# EAGLE schematic copro (EAGLE 8.4.1)
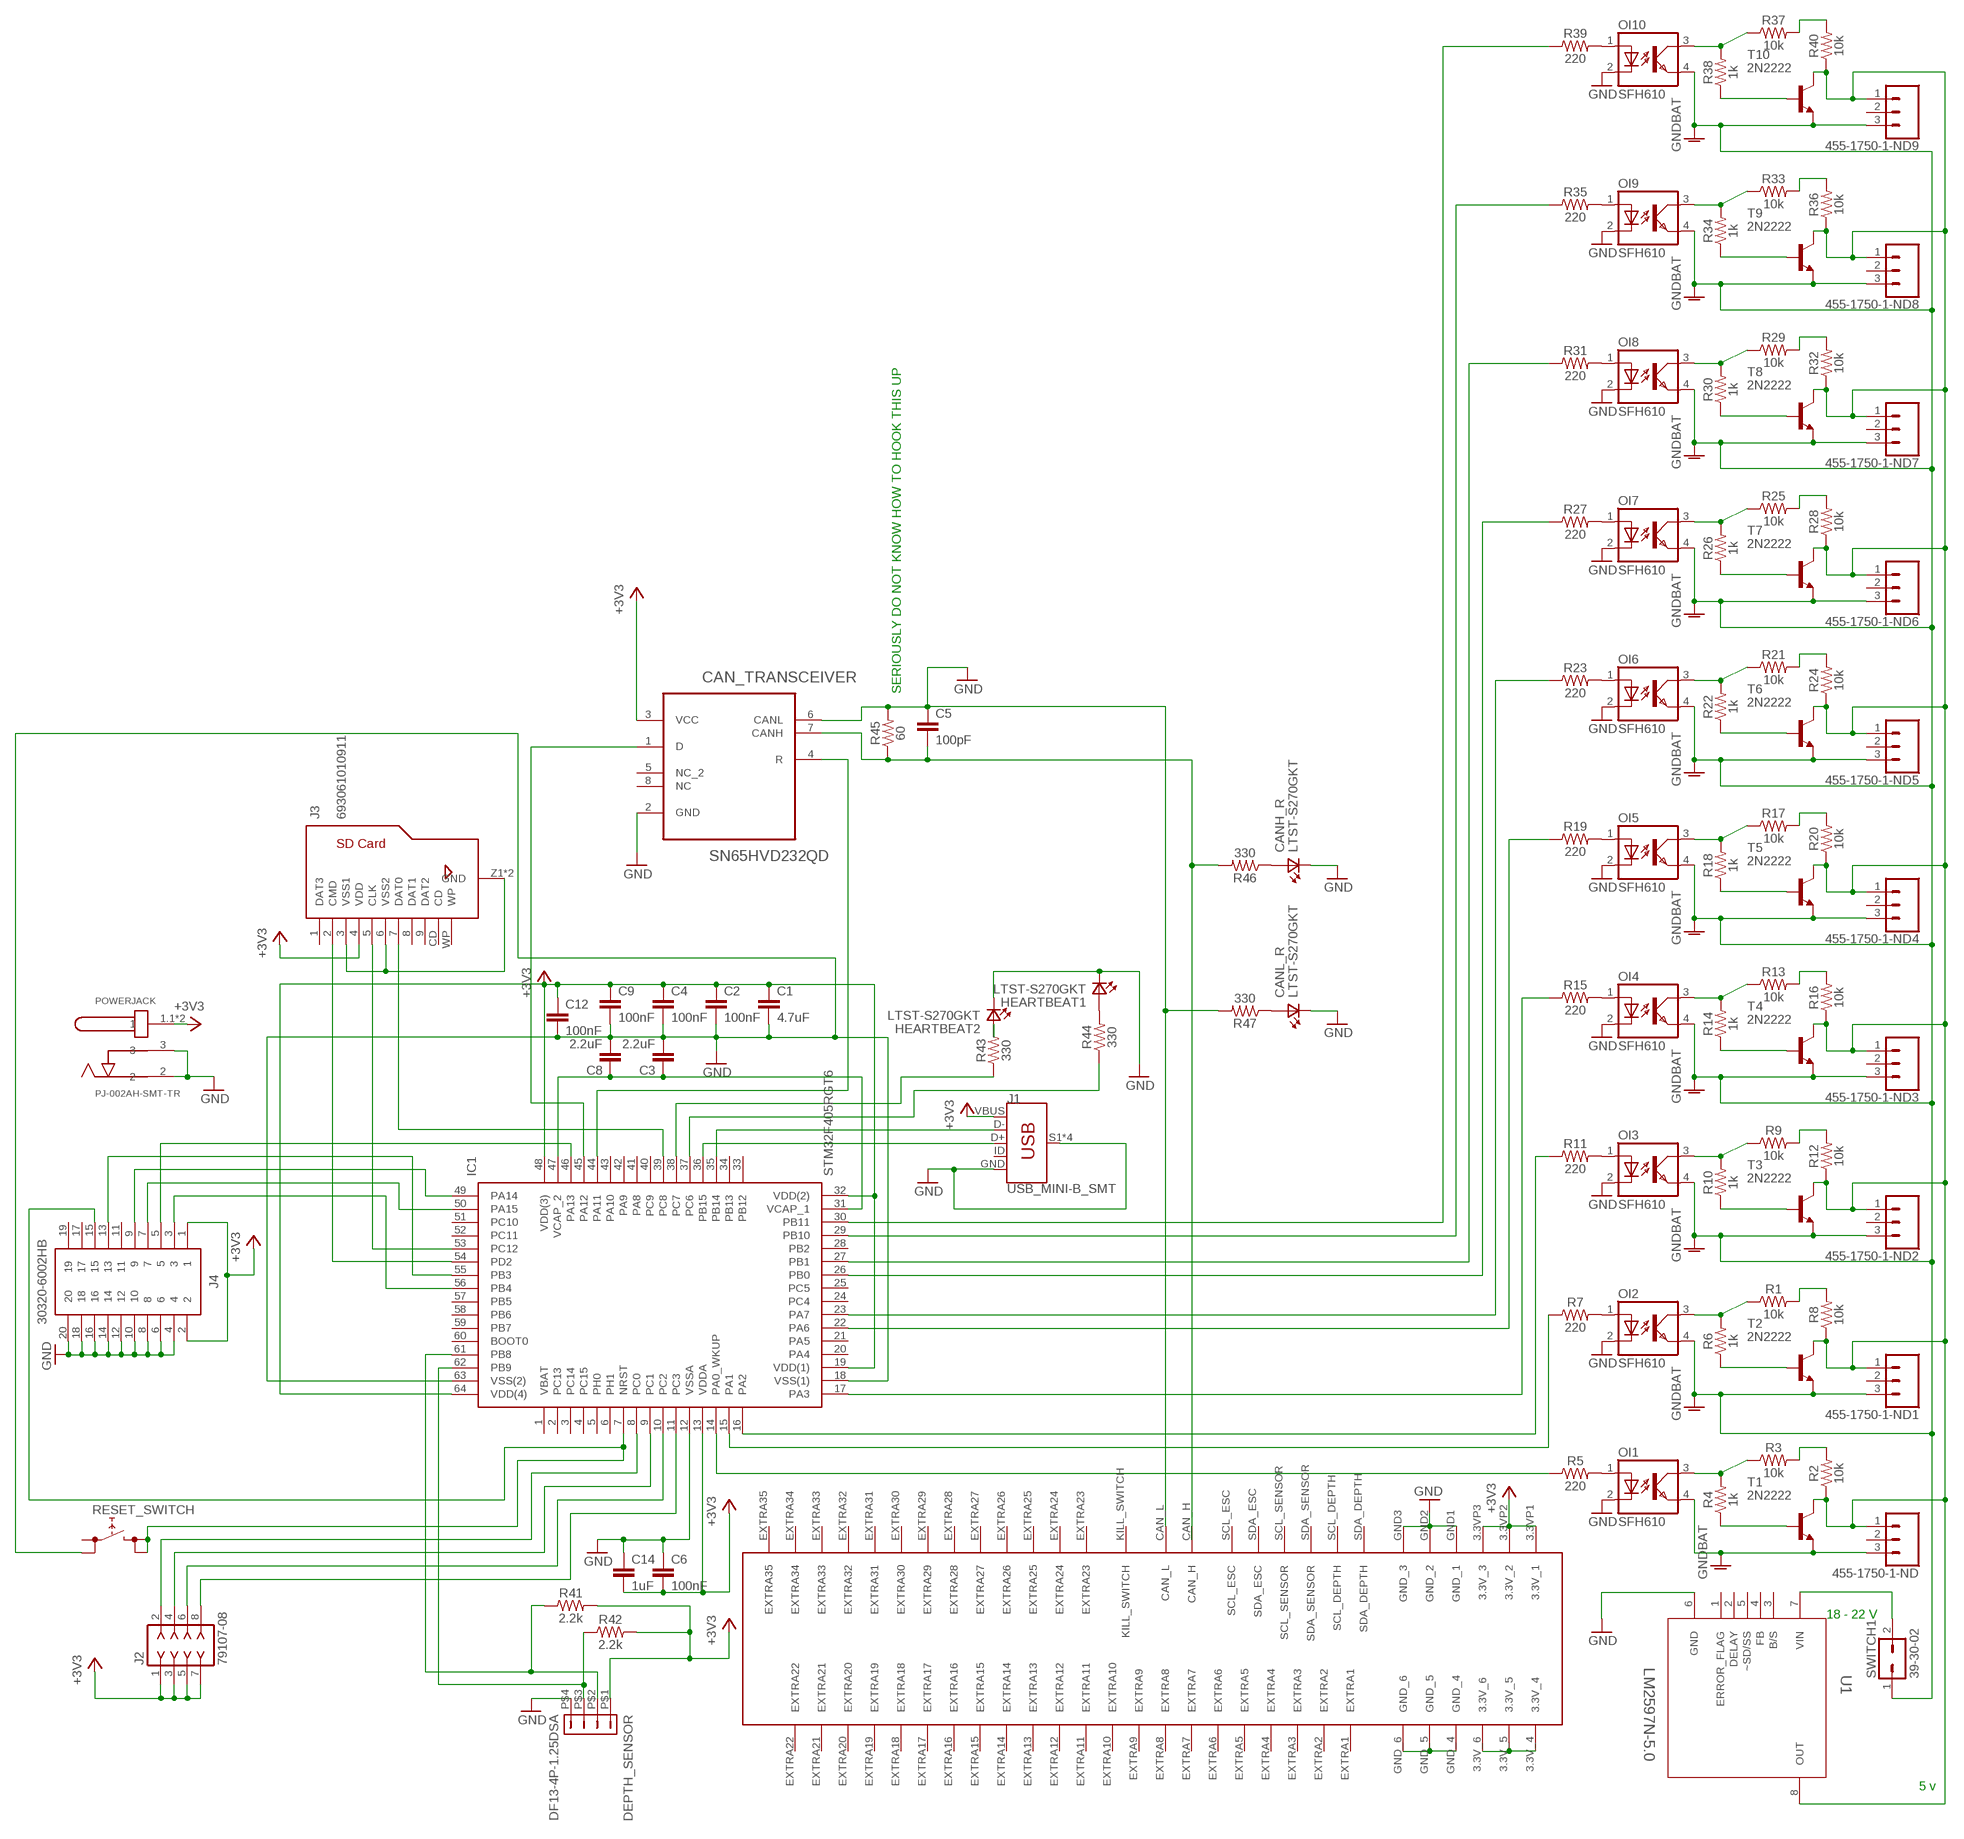
[diagram p0: schematic, sheet 1]

## Parts
455-1750-1-ND  CONN_03  [1X03]
455-1750-1-ND1  CONN_03  [1X03]
455-1750-1-ND2  CONN_03  [1X03]
455-1750-1-ND3  CONN_03  [1X03]
455-1750-1-ND4  CONN_03  [1X03]
455-1750-1-ND5  CONN_03  [1X03]
455-1750-1-ND6  CONN_03  [1X03]
455-1750-1-ND7  CONN_03  [1X03]
455-1750-1-ND8  CONN_03  [1X03]
455-1750-1-ND9  CONN_03  [1X03]
C1  4.7uF  0.1UF-0603-100V-10%  [0603]
C2  100nF  0.1UF-0603-100V-10%  [0603]
C3  2.2uF  0.1UF-0603-100V-10%  [0603]
C4  100nF  0.1UF-0603-100V-10%  [0603]
C5  100pF  0.1UF-0603-100V-10%  [0603]
C6  100nF  0.1UF-0603-100V-10%  [0603]
C8  2.2uF  0.1UF-0603-100V-10%  [0603]
C9  100nF  0.1UF-0603-100V-10%  [0603]
C12  100nF  0.1UF-0603-100V-10%  [0603]
C14  1uF  0.1UF-0603-100V-10%  [0603]
CAN_TRANSCEIVER  SN65HVD232QD  [SOIC127P600X175-8N]
CANH_R  LTST-S270GKT  [0603]
CANL_R  LTST-S270GKT  [0603]
DEPTH_SENSOR  DF13-4P-1.25DSA  [DF13-4P-1.25DSA]
HEARTBEAT1  LTST-S270GKT  [0603]
HEARTBEAT2  LTST-S270GKT  [0603]
IC1  STM32F405RGT6  [QFP50P1200X1200X160-64N]
J1  USB_MINI-B_SMT  [USB-MINIB]
J2  79107-08  [79107-08]
J3  693061010911  [693061010911]
J4  30320-6002HB  [SHDR20W81P254_2X10_3300X840X93]
OI1  SFH610  [DIL04]
OI2  SFH610  [DIL04]
OI3  SFH610  [DIL04]
OI4  SFH610  [DIL04]
OI5  SFH610  [DIL04]
OI6  SFH610  [DIL04]
OI7  SFH610  [DIL04]
OI8  SFH610  [DIL04]
OI9  SFH610  [DIL04]
OI10  SFH610  [DIL04]
POWERJACK  PJ-002AH-SMT-TR  [CUI_PJ-002AH-SMT-TR]
R1  10k  1KOHM-0603-1/10W-1%  [0603]
R2  10k  1KOHM-0603-1/10W-1%  [0603]
R3  10k  1KOHM-0603-1/10W-1%  [0603]
R4  1k  1KOHM-0603-1/10W-1%  [0603]
R5  220  1KOHM-0603-1/10W-1%  [0603]
R6  1k  1KOHM-0603-1/10W-1%  [0603]
R7  220  1KOHM-0603-1/10W-1%  [0603]
R8  10k  1KOHM-0603-1/10W-1%  [0603]
R9  10k  1KOHM-0603-1/10W-1%  [0603]
R10  1k  1KOHM-0603-1/10W-1%  [0603]
R11  220  1KOHM-0603-1/10W-1%  [0603]
R12  10k  1KOHM-0603-1/10W-1%  [0603]
R13  10k  1KOHM-0603-1/10W-1%  [0603]
R14  1k  1KOHM-0603-1/10W-1%  [0603]
R15  220  1KOHM-0603-1/10W-1%  [0603]
R16  10k  1KOHM-0603-1/10W-1%  [0603]
R17  10k  1KOHM-0603-1/10W-1%  [0603]
R18  1k  1KOHM-0603-1/10W-1%  [0603]
R19  220  1KOHM-0603-1/10W-1%  [0603]
R20  10k  1KOHM-0603-1/10W-1%  [0603]
R21  10k  1KOHM-0603-1/10W-1%  [0603]
R22  1k  1KOHM-0603-1/10W-1%  [0603]
R23  220  1KOHM-0603-1/10W-1%  [0603]
R24  10k  1KOHM-0603-1/10W-1%  [0603]
R25  10k  1KOHM-0603-1/10W-1%  [0603]
R26  1k  1KOHM-0603-1/10W-1%  [0603]
R27  220  1KOHM-0603-1/10W-1%  [0603]
R28  10k  1KOHM-0603-1/10W-1%  [0603]
R29  10k  1KOHM-0603-1/10W-1%  [0603]
R30  1k  1KOHM-0603-1/10W-1%  [0603]
R31  220  1KOHM-0603-1/10W-1%  [0603]
R32  10k  1KOHM-0603-1/10W-1%  [0603]
R33  10k  1KOHM-0603-1/10W-1%  [0603]
R34  1k  1KOHM-0603-1/10W-1%  [0603]
R35  220  1KOHM-0603-1/10W-1%  [0603]
R36  10k  1KOHM-0603-1/10W-1%  [0603]
R37  10k  1KOHM-0603-1/10W-1%  [0603]
R38  1k  1KOHM-0603-1/10W-1%  [0603]
R39  220  1KOHM-0603-1/10W-1%  [0603]
R40  10k  1KOHM-0603-1/10W-1%  [0603]
R41  2.2k  1KOHM-0603-1/10W-1%  [0603]
R42  2.2k  1KOHM-0603-1/10W-1%  [0603]
R43  330  1KOHM-0603-1/10W-1%  [0603]
R44  330  1KOHM-0603-1/10W-1%  [0603]
R45  60  1KOHM-0603-1/10W-1%  [0603]
R46  330  1KOHM-0603-1/10W-1%  [0603]
R47  330  1KOHM-0603-1/10W-1%  [0603]
RESET_SWITCH  REKN  [REKN]
SWITCH1  39-30-02  [39-30-?02?]
T1  2N2222  [TO18]
T2  2N2222  [TO18]
T3  2N2222  [TO18]
T4  2N2222  [TO18]
T5  2N2222  [TO18]
T6  2N2222  [TO18]
T7  2N2222  [TO18]
T8  2N2222  [TO18]
T9  2N2222  [TO18]
T10  2N2222  [TO18]
U1  LM2597N-5.0  [DIP254P762X508-8]
U$1  5530843  [5530843-6-BOARDFINGERS]

## Nets
3.3V: U$1.3.3VP1(3.3V_1) U$1.3.3VP2(3.3V_2) U$1.3.3VP3(3.3V_3) ; supply symbol labelled +3V3
+3V3: C1.1 C2.1 C4.1 C6.2 C9.1 C12.1 C14.2 CAN_TRANSCEIVER.3(VCC) DEPTH_SENSOR.P$1 IC1.13(VDDA) IC1.19(VDD(1)) IC1.32(VDD(2)) IC1.48(VDD(3)) IC1.64(VDD(4)) J1.VBUS J2.1 J2.3 J2.5 J2.7 J3.4(VDD) J4.1 J4.2 POWERJACK.1.1 POWERJACK.1.2 R41.2 R42.2
CANH: C5.2 CAN_TRANSCEIVER.7(CANH) R45.1 R46.2 U$1.CAN_H
CANL: C5.1 CAN_TRANSCEIVER.6(CANL) R45.2 R47.2 U$1.CAN_L ; supply symbol labelled GND
CLK: IC1.53(PC12) J3.5(CLK)
CMD: IC1.54(PD2) J3.2(CMD)
D+: IC1.36(PB15) J1.D+
D-: IC1.35(PB14) J1.D-
DATO: IC1.39(PC8) J3.7(DAT0)
GND: C1.2 C2.2 C3.2 C4.2 C6.1 C8.2 C9.2 C12.2 C14.1 CAN_TRANSCEIVER.2(GND) CANH_R.1(K2) CANL_R.1(K2) DEPTH_SENSOR.P$4 HEARTBEAT1.1(K2) HEARTBEAT2.1(K2) IC1.12(VSSA) IC1.18(VSS(1)) IC1.63(VSS(2)) J1.GND J1.S1(SHIELD) J1.S2(SHIELD) J1.S3(SHIELD) J1.S4(SHIELD) J4.4 J4.6 J4.8 J4.10 J4.12 J4.14 J4.16 J4.18 J4.20 OI1.2(C) OI2.2(C) OI3.2(C) OI4.2(C) OI5.2(C) OI6.2(C) OI7.2(C) OI8.2(C) OI9.2(C) OI10.2(C) POWERJACK.2 POWERJACK.3 RESET_SWITCH.0B U1.6(GND) U$1.GND1(GND_1) U$1.GND2(GND_2) U$1.GND3(GND_3) U$1.GND_4 U$1.GND_5 U$1.GND_6
GNDA: 455-1750-1-ND1.3 455-1750-1-ND2.3 455-1750-1-ND3.3 455-1750-1-ND4.3 455-1750-1-ND5.3 455-1750-1-ND6.3 455-1750-1-ND7.3 455-1750-1-ND8.3 455-1750-1-ND9.3 OI2.4(EMIT) OI3.4(EMIT) OI4.4(EMIT) OI5.4(EMIT) OI6.4(EMIT) OI7.4(EMIT) OI8.4(EMIT) OI9.4(EMIT) OI10.4(EMIT) SWITCH1.1 T2.1(E) T3.1(E) T4.1(E) T5.1(E) T6.1(E) T7.1(E) T8.1(E) T9.1(E) T10.1(E) ; supply symbol labelled GNDBAT
GNDBAT: 455-1750-1-ND.3 OI1.4(EMIT) T1.1(E)
HEARTBEAT1: IC1.37(PC6) R44.1
HEARTBEAT2: IC1.38(PC7) R43.1
JTAG3: IC1.56(PB4) J4.3
JTAG5: IC1.46(PA13) J4.5
JTAG9: IC1.49(PA14) J4.9
JTAG13: IC1.55(PB3) J4.13
JTAG15: IC1.7(NRST) J4.15 RESET_SWITCH.1A RESET_SWITCH.1B
N$1: OI2.3(COL) R1.1 R6.2
N$2: R4.1 T1.2(B)
N$3: C3.1 C8.1 IC1.31(VCAP_1) IC1.47(VCAP_2)
N$4: OI1.1(A) R5.2
N$6: OI1.3(COL) R3.1 R4.2
N$7: SWITCH1.2 U1.7(VIN)
N$8: CANL_R.2(A2) R47.1
N$9: R6.1 T2.2(B)
N$10: R2.2 R3.2
N$11: OI2.1(A) R7.2
N$13: IC1.14(PA0_WKUP) R5.1
N$14: HEARTBEAT2.2(A2) R43.2
N$15: R1.2 R8.2
N$16: OI3.3(COL) R9.1 R10.2
N$17: R10.1 T3.2(B)
N$18: 455-1750-1-ND1.1 455-1750-1-ND2.1 455-1750-1-ND3.1 455-1750-1-ND4.1 455-1750-1-ND5.1 455-1750-1-ND6.1 455-1750-1-ND7.1 455-1750-1-ND8.1 455-1750-1-ND9.1 455-1750-1-ND.1 R2.1 R8.1 R12.1 R16.1 R20.1 R24.1 R28.1 R32.1 R36.1 R40.1 T1.3(C) T2.3(C) T3.3(C) T4.3(C) T5.3(C) T6.3(C) T7.3(C) T8.3(C) T9.3(C) T10.3(C) U1.8(OUT)
N$19: OI3.1(A) R11.2
N$20: IC1.8(PC0) J2.2
N$21: J3.3(VSS1) J3.6(VSS2) J3.Z1(GND) J3.Z2(GND)
N$22: R9.2 R12.2
N$23: OI4.3(COL) R13.1 R14.2
N$24: R14.1 T4.2(B)
N$25: IC1.9(PC1) J2.4
N$26: OI4.1(A) R15.2
N$27: IC1.10(PC2) J2.6
N$28: HEARTBEAT1.2(A2) R44.2
N$29: R13.2 R16.2
N$30: OI5.3(COL) R17.1 R18.2
N$31: R18.1 T5.2(B)
N$32: IC1.11(PC3) J2.8
N$33: OI5.1(A) R19.2
N$34: CANH_R.2(A2) R46.1
N$36: R17.2 R20.2
N$37: OI6.3(COL) R21.1 R22.2
N$38: R22.1 T6.2(B)
N$40: OI6.1(A) R23.2
N$43: R21.2 R24.2
N$44: OI7.3(COL) R25.1 R26.2
N$45: R26.1 T7.2(B)
N$47: OI7.1(A) R27.2
N$50: R25.2 R28.2
N$51: OI8.3(COL) R29.1 R30.2
N$52: R30.1 T8.2(B)
N$54: OI8.1(A) R31.2
N$57: R29.2 R32.2
N$58: OI9.3(COL) R33.1 R34.2
N$59: R34.1 T9.2(B)
N$61: OI9.1(A) R35.2
N$64: R33.2 R36.2
N$65: OI10.3(COL) R37.1 R38.2
N$66: R38.1 T10.2(B)
N$68: OI10.1(A) R39.2
N$71: R37.2 R40.2
OI2: IC1.15(PA1) R7.1
OI3: IC1.16(PA2) R11.1
OI4: IC1.17(PA3) R15.1
OI5: IC1.22(PA6) R19.1
OI6: IC1.23(PA7) R23.1
OI7: IC1.26(PB0) R27.1
OI8: IC1.27(PB1) R31.1
OI10: IC1.30(PB11) R39.1
OIO9: IC1.29(PB10) R35.1
PA15: IC1.50(PA15) J4.7
PB8: DEPTH_SENSOR.P$2 IC1.61(PB8) R41.1
POWER: U$1.3.3V_4 U$1.3.3V_5 U$1.3.3V_6
PS$3: DEPTH_SENSOR.P$3 IC1.62(PB9) R42.1
RXD: CAN_TRANSCEIVER.4(R) IC1.44(PA11)
TXD: CAN_TRANSCEIVER.1(D) IC1.45(PA12)
Unconnected: 455-1750-1-ND1.2 455-1750-1-ND2.2 455-1750-1-ND3.2 455-1750-1-ND4.2 455-1750-1-ND5.2 455-1750-1-ND6.2 455-1750-1-ND7.2 455-1750-1-ND8.2 455-1750-1-ND9.2 455-1750-1-ND.2 CAN_TRANSCEIVER.5(NC_2) CAN_TRANSCEIVER.8(NC) IC1.1(VBAT) IC1.2(PC13) IC1.3(PC14) IC1.4(PC15) IC1.5(PH0) IC1.6(PH1) IC1.20(PA4) IC1.21(PA5) IC1.24(PC4) IC1.25(PC5) IC1.28(PB2) IC1.33(PB12) IC1.34(PB13) IC1.40(PC9) IC1.41(PA8) IC1.42(PA9) IC1.43(PA10) IC1.51(PC10) IC1.52(PC11) IC1.57(PB5) IC1.58(PB6) IC1.59(PB7) IC1.60(BOOT0) J1.ID J3.1(DAT3) J3.8(DAT1) J3.9(DAT2) J3.CD J3.WP J4.11 J4.17 J4.19 RESET_SWITCH.0A U1.1(ERROR_FLAG) U1.2(DELAY) U1.3(B/S) U1.4(FB) U1.5(~SD/SS) U$1.EXTRA1 U$1.EXTRA2 U$1.EXTRA3 U$1.EXTRA4 U$1.EXTRA5 U$1.EXTRA6 U$1.EXTRA7 U$1.EXTRA8 U$1.EXTRA9 U$1.EXTRA10 U$1.EXTRA11 U$1.EXTRA12 U$1.EXTRA13 U$1.EXTRA14 U$1.EXTRA15 U$1.EXTRA16 U$1.EXTRA17 U$1.EXTRA18 U$1.EXTRA19 U$1.EXTRA20 U$1.EXTRA21 U$1.EXTRA22 U$1.EXTRA23 U$1.EXTRA24 U$1.EXTRA25 U$1.EXTRA26 U$1.EXTRA27 U$1.EXTRA28 U$1.EXTRA29 U$1.EXTRA30 U$1.EXTRA31 U$1.EXTRA32 U$1.EXTRA33 U$1.EXTRA34 U$1.EXTRA35 U$1.KILL_SWITCH U$1.SCL_DEPTH U$1.SCL_ESC U$1.SCL_SENSOR U$1.SDA_DEPTH U$1.SDA_ESC U$1.SDA_SENSOR

## Notes on the sheet
- SERIOUSLY DO NOT KNOW HOW TO HOOK THIS UP
- 18 - 22 V
- 5 v

## Library data of the parts
455-1750-1-ND 455-1750-1-ND1-455-1750-1-ND9 = SparkFun-Connectors:CONN_03: Multi connection point. Often used as Generic Header-pin footprint for 0.1 inch spaced/style header connections On any of the 0.1 inch spaced packages, you can populate with these: Break Away Headers - Straight <https://www.sparkfun.com/products/116> (PRT-00116) Break Away Male Headers - Right Angle <https://www.sparkfun.com/products/553> (PRT-00553) Female Headers <https://www.sparkfun.com/products/115> (PRT-00115) Break Away Headers - Machine Pin <https://www.sparkfun.com/products/117> (PRT-00117) Break Away Female Headers - Swiss Machine Pin <https://www.sparkfun.com/products/743> (PRT-00743) Stackable Header - 3 Pin (Female, 0.1") <https://www.sparkfun.com/products/13875> (PRT-13875) For SCREWTERMINALS and SPRING TERMINALS visit here: Screw Terimnals on SparkFun.com <https://www.sparkfun.com/search/results?term=Screw+Terminals> (5mm/3.5mm/2.54mm spacing) This device is also useful as a general connection point to wire up your design to another part of your project. Our various solder wires solder well into these plated through hole pads. Hook-Up Wire - Assortment (Stranded, 22 AWG) <https://www.sparkfun.com/products/11375> (PRT-11375) Hook-Up Wire - Assortment (Solid Core, 22 AWG) <https://www.sparkfun.com/products/11367> (PRT-11367) View the entire wire category on our website here <https://www.sparkfun.com/categories/141> Special notes: Molex polarized connector foot print use with SKU : PRT-08232 with associated crimp pins and housings.; PROD_ID: XXX-00000; VALUE: 455-1750-1-ND
C1-C6 C8 C9 C12 C14 = SparkFun-Capacitors:0.1UF: 0.1µF ceramic capacitors A capacitor is a passive two-terminal electrical component used to store electrical energy temporarily in an electric field.; PROD_ID: CAP-08390; VALUE: 0.1uF
CAN_TRANSCEIVER = SN65HVD232QD:SN65HVD232QD: 3.3-V CAN TRANSCEIVERS; AVAILABILITY: Good; DESCRIPTION: Automotive Catalog 3.3-V CAN Transceiver 8-SOIC -40 to 125; MF: Texas Instruments; MP: SN65HVD232QD; PACKAGE: SOIC-8 Texas Instruments; PRICE: 1.82 USD
CANH_R CANL_R HEARTBEAT1 HEARTBEAT2 = LTST-S270GKT:LTST-S270GKT: https://octopart.com/ltst-c190gkt-lite-on-549821; AVAILABILITY: Good; DESCRIPTION: Green 1.6 x 0.6 x 1.15 mm 130° Water Clear 12 mcd 2.1 V Molded SMT LED; MF: Lite-On; MP: LTST-S270GKT; PACKAGE: 0603 Lite-On; PRICE: 0.08 USD
DEPTH_SENSOR = con-hirose-df13:DF13-4P-1.25: DF13-4P 1.25mm Pitch Miniature Crimping Connector.
IC1 = STM32F405RGT6:STM32F405RGT6: MCU 32-Bit, ARM Cortex M4, 1MB Flash STMicroelectronics STM32F405RGT6, 32bit ARM Cortex M4F Microcontroller, 168MHz, 1024 kB Flash, 64-Pin LQFP <https://componentsearchengine.com/Images/3/STM32F405RGT6.jpg> Source: Datasheet <http://www.st.com/web/en/resource/technical/document/datasheet/DM00037051.pdf>; ALLIED_NUMBER: 70391099; DESCRIPTION: MCU 32-Bit, ARM Cortex M4, 1MB Flash STMicroelectronics STM32F405RGT6, 32bit ARM Cortex M4F Microcontroller, 168MHz, 1024 kB Flash, 64-Pin LQFP; HEIGHT: 1.6mm; MANUFACTURER_NAME: STMicroelectronics; MANUFACTURER_PART_NUMBER: STM32F405RGT6; RS_PART_NUMBER: 7468217; SUPPLIER_NAME: RS
J1 = SparkFun-Connectors:USB_MINI-B: USB type Mini-B Connector Breaks out 5th pin, and includes shield pins if needed. SparkFun Products: SparkFun FTDI Basic Breakout <https://www.sparkfun.com/products/9716> SparkFun XBee Explorer USB <https://www.sparkfun.com/products/11812> SparkFun Redboard <https://www.sparkfun.com/products/12757>; PROD_ID: CONN-08193; SF_ID: PRT-00587
J2 = con-molex-milli-grid:79107-08: RECEPTACAL
J3 = 693061010911:693061010911: WR-CRD SD CARD CONNECTOR PUSH & PUSH WITH CARD DETECTION 9 PINS=>Code : Con_I-O_COM_CRD_SD_Normal_693061010911 <http://katalog.we-online.de/media/images/eican/Con_I-O_COM_CRD_SD_Normal_693061010911_pf2.jpg> Details see: http://katalog.we-online.de/em/datasheet/693061010911.pdf Created 2014-07-09, Karrer Zheng 2014 (C) Würth Elektronik; AVAILABILITY: Good; DESCRIPTION: SD-Card Connector [Würth Elektronik] 693061010911 SD-Card Connector; MF: Würth Elektronik; MP: 693061010911; PACKAGE: None; PRICE: 4.22 USD
J4 = 30320-6002HB:30320-6002HB: Header 20 position 3M 303 Series, 2.54mm Pitch 20 Way 2 Row Shrouded Straight PCB Header, Through Hole, Solder Termination <https://componentsearchengine.com/Images/3/30320-6002HB.jpg> Source: Datasheet <http://multimedia.3m.com/mws/media/22504O/3mtm-100-in-loprof-hdr-100x-100strt-ra-4-wall-ts0818.pdf>; DESCRIPTION: Header 20 position 3M 303 Series, 2.54mm Pitch 20 Way 2 Row Shrouded Straight PCB Header, Through Hole, Solder Termination; HEIGHT: 9.3mm; MANUFACTURER_NAME: 3M; MANUFACTURER_PART_NUMBER: 30320-6002HB; RS_PART_NUMBER: 8273587; SUPPLIER_NAME: RS
OI1-OI10 = optocoupler:SFH610: SIEMENS OPTO COUPLER; MF: VISHAY/TELEFUNKEN; MPN: SFH6106-4; OC_FARNELL: 1469568; OC_NEWARK: 58K2193
POWERJACK = PJ-002AH-SMT-TR:PJ-002AH-SMT-TR: PJ-002 Series 2 x 6.5 mm 24 V Right Angle SMT Power Jack; AVAILABILITY: Good; DESCRIPTION: 24 VDC 5 A Surface Mount Unshielded 2 Conductors 3 Contacts Male Power Jack; MF: CUI; MP: PJ-002AH-SMT-TR; PACKAGE: None; PRICE: 0.98 USD
R1-R3 R5 R7-R9 R11-R13 R15-R17 R19-R21 R23-R25 R27-R29 R31-R33 R35-R37 R39-R47 = SparkFun-Resistors:1KOHM: 1kΩ resistor A resistor is a passive two-terminal electrical component that implements electrical resistance as a circuit element. Resistors act to reduce current flow, and, at the same time, act to lower voltage levels within circuits. - Wikipedia; PROD_ID: RES-07856; VALUE: 1k
R4 R6 R10 R14 R18 R22 R26 R30 R34 R38 = SparkFun-Resistors:1KOHM: 1kΩ resistor A resistor is a passive two-terminal electrical component that implements electrical resistance as a circuit element. Resistors act to reduce current flow, and, at the same time, act to lower voltage levels within circuits. - Wikipedia; PROD_ID: RES-07856
RESET_SWITCH = switch:REKN: PUSH SWITCH ITT-Cannon-Cannon
SWITCH1 = con-molex-mini-fit:39-30-?02?: HEADER
T1-T10 = transistor:2N2222: NPN TRANSISTOR
U1 = LM2597N-5.0:LM2597N-5.0: SIMPLE SWITCHER; AVAILABILITY: Bad; DESCRIPTION: SIMPLE SWITCHER Power Converter 150 kHz 0.5A Step-Down Voltage Regulator 8-PDIP; MF: Texas Instruments; MP: LM2597N-5.0; PACKAGE: SOIC-8 Texas Instruments; PRICE: 1.62 USD
U$1 = 5530843-6:5530843